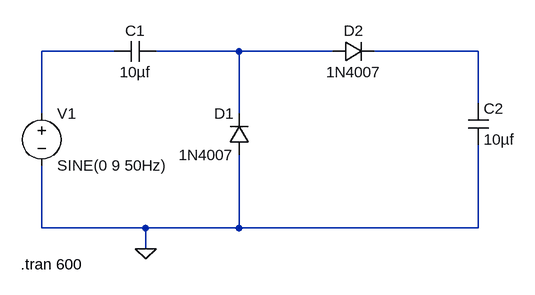
[diagram p0: schematic Day4_Grienacher Voltage Doubler.asc]
Day4_Grienacher Voltage Doubler.asc, the LTspice schematic file:
Version 4.1
SHEET 1 880 680
WIRE -560 -32 -672 -32
WIRE -368 -32 -496 -32
WIRE -224 -32 -368 -32
WIRE 0 -32 -160 -32
WIRE 0 48 0 -32
WIRE -672 64 -672 -32
WIRE -368 64 -368 -32
WIRE -672 240 -672 144
WIRE -512 240 -672 240
WIRE -368 240 -368 128
WIRE -368 240 -512 240
WIRE 0 240 0 112
WIRE 0 240 -368 240
WIRE -512 272 -512 240
FLAG -512 272 0
SYMBOL voltage -672 48 R0
WINDOW 123 0 0 Left 0
WINDOW 39 0 0 Left 0
SYMATTR InstName V1
SYMATTR Value SINE(0 9 50Hz)
SYMBOL diode -352 128 R180
WINDOW 0 24 64 Left 2
WINDOW 3 24 0 Left 2
SYMATTR InstName D1
SYMATTR Value 1N4007
SYMBOL cap -496 -48 R90
WINDOW 0 0 32 VBottom 2
WINDOW 3 32 32 VTop 2
SYMATTR InstName C1
SYMATTR Value 10µf
SYMBOL diode -224 -16 R270
WINDOW 0 32 32 VTop 2
WINDOW 3 0 32 VBottom 2
SYMATTR InstName D2
SYMATTR Value 1N4007
SYMBOL cap -16 48 R0
SYMATTR InstName C2
SYMATTR Value 10µf
TEXT -704 296 Left 2 !.tran 600

The netlist it stands for:
* Day4_Grienacher Voltage Doubler.asc
V1 N001 0 SINE(0 9 50Hz)
D1 0 N002 1N4007
C1 N002 N001 10µf
D2 N002 N003 1N4007
C2 N003 0 10µf
.model D D
.lib standard.dio
.tran 600
.backanno
.end